# Altium project ESP32_MIC.PrjPCB
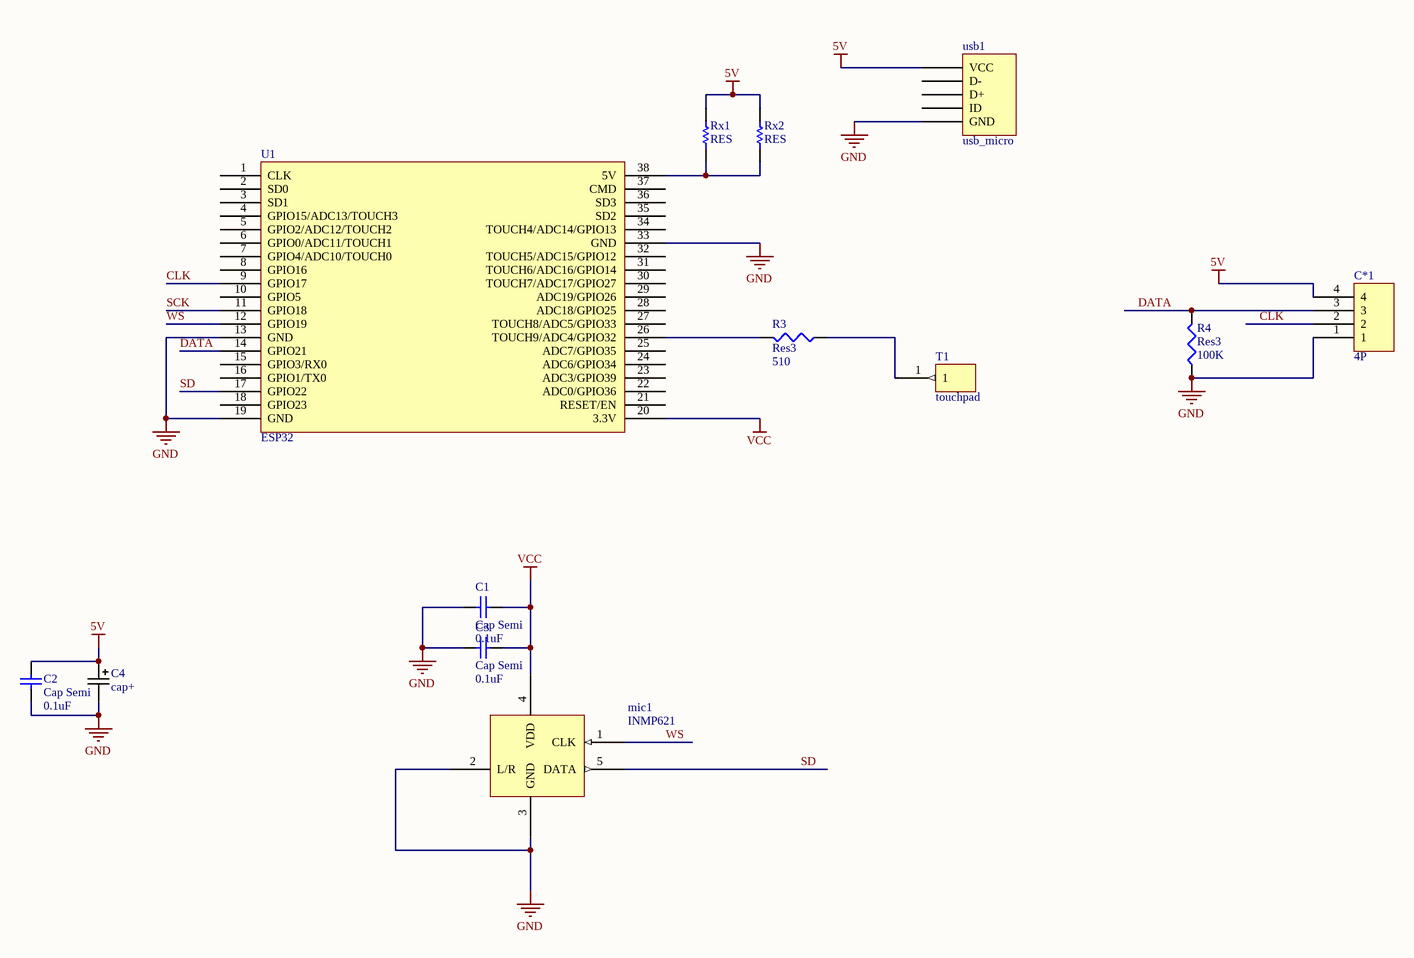
[diagram p0: Sheet2.SchDoc]
1 sheet, 13 parts. Net scope: global (net labels, ports and power ports of the same name join across sheets).
Board file: PCB1.PcbDoc

## Sheet Sheet2.SchDoc
size A3; Organization: Altium Limited; Address1: L3, 12a Rodborough Rd; Address2: Frenchs Forest; Address3: NSW; Address4: Australia 2086

### Parts
C1  Cap Semi  value 0.1uF  [1608[0603]]
C2  Cap Semi  value 0.1uF  [1608[0603]]
C3  Cap Semi  value 0.1uF  [1608[0603]]
C4  cap+  [cap_SMD]
C*1  4P  [XH2.54_4P]
mic1  INMP621  [INMP621]
R3  Res3  value 510  [6-0805_M]
R4  Res3  value 100K  [6-0805_M]
Rx1  RES  [RES_2512]
Rx2  RES  [RES_2512]
T1  touchpad  [touchpad]
U1  ESP32  [ESP32_S]
usb1  usb_micro  [USB_micro]

### Nets
5V: C2.2 C4.1 C*1.4 Rx1.2 Rx2.2 usb1.1(VCC)
GND: C1.2 C2.1 C3.2 C4.2 C*1.1 mic1.2(L/R) mic1.3(GND) R4.1 U1.13(GND) U1.19(GND) U1.33(GND) usb1.5(GND)
VCC: C1.1 C3.1 mic1.4(VDD) U1.20(3.3V)
CLK: C*1.2 U1.9(GPIO17)
DATA: C*1.3 R4.2 U1.14(GPIO21)
SCK: U1.11(GPIO18)
SD: mic1.5(DATA) U1.17(GPIO22)
WS: mic1.1(CLK) U1.12(GPIO19)
NetR3_1: R3.1 T1.1
NetR3_2: R3.2 U1.26(TOUCH9/ADC4/GPIO32)
NetRx1_1: Rx1.1 Rx2.1 U1.38(5V)

Not connected (* = marked no-connect by the designer): U1 1(CLK) 2(SD0) 3(SD1) 4(GPIO15/ADC13/TOUCH3) 5(GPIO2/ADC12/TOUCH2) 6(GPIO0/ADC11/TOUCH1) 7(GPIO4/ADC10/TOUCH0) 8(GPIO16) 10(GPIO5) 15(GPIO3/RX0) 16(GPIO1/TX0) 18(GPIO23) 21(RESET/EN) 22(ADC0/GPIO36) 23(ADC3/GPIO39) 24(ADC6/GPIO34) 25(ADC7/GPIO35) 27(TOUCH8/ADC5/GPIO33) 28(ADC18/GPIO25) 29(ADC19/GPIO26) 30(TOUCH7/ADC17/GPIO27) 31(TOUCH6/ADC16/GPIO14) 32(TOUCH5/ADC15/GPIO12) 34(TOUCH4/ADC14/GPIO13) 35(SD2) 36(SD3) 37(CMD); usb1 2(D-) 3(D+) 4(ID)

### Notes on the sheet
- Title
- Size:
- Date:
- A3
- Number:
- Time:
- Revision:
- Sheet
- of
- File:

### Library data of the parts
C1-C3 = Cap Semi: Capacitor (Semiconductor SIM Model); Published: 8-Jun-2000; LatestRevisionDate: 29-May-2009; LatestRevisionNote: IPC-7351 Footprint Added.; PackageReference: C1206; Publisher: Altium Limited; PackageDescription: Chip Capacitor
R3 R4 = Res3: Resistor; Published: 8-Jun-2000; LatestRevisionDate: 29-May-2009; LatestRevisionNote: IPC-7351 Footprint Added.; PackageReference: J1-0603; Publisher: Altium Limited; PackageDescription: Chip Resistor